# Altium schematic sheet ad7768.SchDoc
size A4; SheetNumber: 1; SheetTotal: 6
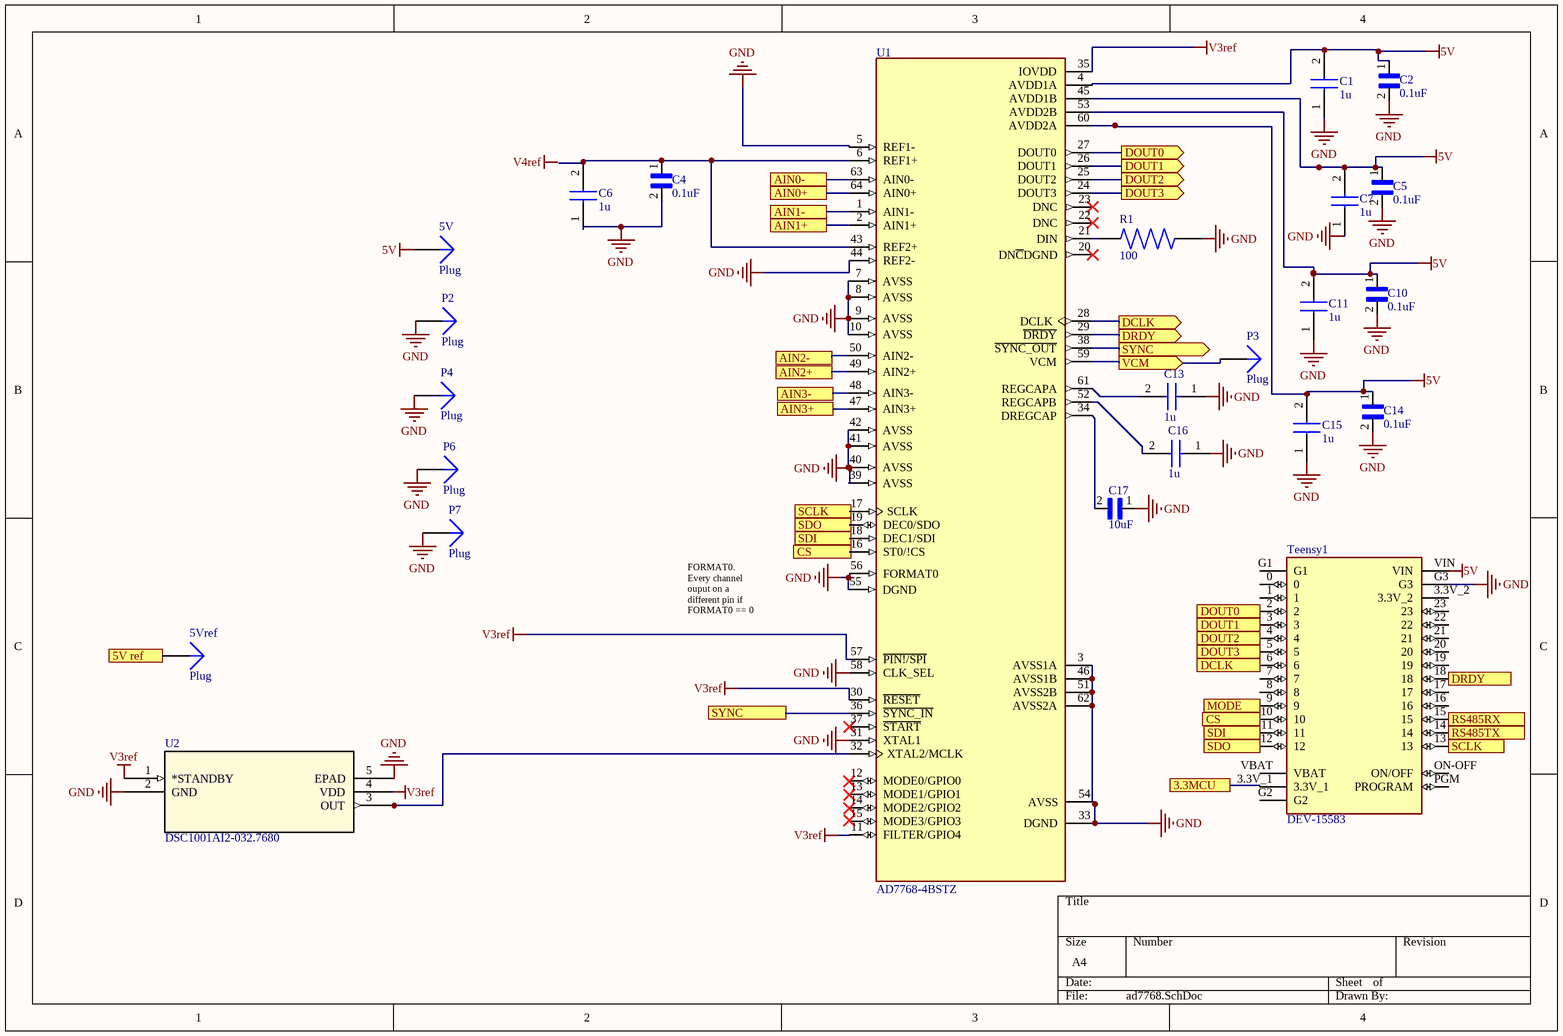
[diagram p0: ad7768.SchDoc]

## Parts
5V  Plug  [PIN1]
5Vref  Plug  [PIN1]
C1  1u  [CAPC1608X90N]
C2  0.1uF  [CAPC1608X90N]
C4  0.1uF  [CAPC1608X90N]
C5  0.1uF  [CAPC1608X90N]
C6  1u  [CAPC1608X90N]
C7  1u  [CAPC1608X90N]
C10  0.1uF  [CAPC1608X90N]
C11  1u  [CAPC1608X90N]
C13  1u  [CAPC1608X90N]
C14  0.1uF  [CAPC1608X90N]
C15  1u  [CAPC1608X90N]
C16  1u  [CAPC1608X90N]
C17  10uF  [CAPC1608X9N]
P2  Plug  [PIN1]
P3  Plug  [PIN1]
P4  Plug  [PIN1]
P6  Plug  [PIN1]
P7  Plug  [PIN1]
R1  100  [RESC1508X55N]
Teensy1  DEV-15583  [MODULE_DEV-15583]
U1  AD7768-4BSTZ
U2  DSC1001AI2-032.7680  [DFN4_7X5_MCH]

## Ports
3.3MCU, 5V ref, AIN0+, AIN0-, AIN1+, AIN1-, AIN2+, AIN2-, AIN3+, AIN3-, CS, DCLK (out), DOUT0 (out), DOUT1 (out), DOUT2 (out), DOUT3 (out), DRDY (out), MODE, RS485RX, RS485TX, SCLK, SDI, SDO, SYNC, SYNC (out), VCM (out)

## Nets
5V: 5V.1 C1.2 C2.1 C5.1 C7.2 C10.1 C11.2 C14.1 C15.2 Teensy1.VIN U1.4(AVDD1A) U1.45(AVDD1B) U1.53(AVDD2B) U1.60(AVDD2A)
GND: C1.1 C2.2 C4.2 C5.2 C6.1 C7.1 C10.2 C11.1 C13.1 C14.2 C15.1 C16.1 C17.1 P2.1 P4.1 P6.1 P7.1 R1.2 Teensy1.G3 U1.3(AVSS1A) U1.5(REF1-) U1.7(AVSS) U1.8(AVSS) U1.9(AVSS) U1.10(AVSS) U1.31(XTAL1) U1.33(DGND) U1.39(AVSS) U1.40(AVSS) U1.41(AVSS) U1.42(AVSS) U1.44(REF2-) U1.46(AVSS1B) U1.51(AVSS2B) U1.54(AVSS) U1.55(DGND) U1.56(FORMAT0) U1.58(CLK_SEL) U1.62(AVSS2A) U2.2(GND) U2.5(EPAD)
V3ref: U1.11(FILTER/GPIO4) U1.30(~{RESET}) U1.35(IOVDD) U1.57(~{PIN!/SPI}) U2.1(*STANDBY) U2.4(VDD)
3.3MCU: Teensy1.3.3V_1 ; port 3.3MCU
5V ref: 5Vref.1 ; port 5V ref
AIN0+: U1.64(AIN0+) ; port AIN0+
AIN0-: U1.63(AIN0-) ; port AIN0-
AIN1+: U1.2(AIN1+) ; port AIN1+
AIN1-: U1.1(AIN1-) ; port AIN1-
AIN2+: U1.49(AIN2+) ; port AIN2+
AIN2-: U1.50(AIN2-) ; port AIN2-
AIN3+: U1.47(AIN3+) ; port AIN3+
AIN3-: U1.48(AIN3-) ; port AIN3-
CS: Teensy1.10 U1.16(ST0/!CS) ; port CS
DCLK: Teensy1.6 U1.28(DCLK) ; port DCLK
DOUT0: Teensy1.2 U1.27(DOUT0) ; port DOUT0
DOUT1: Teensy1.3 U1.26(DOUT1) ; port DOUT1
DOUT2: Teensy1.4 U1.25(DOUT2) ; port DOUT2
DOUT3: Teensy1.5 U1.24(DOUT3) ; port DOUT3
DRDY: Teensy1.18 U1.29(~{DRDY}) ; port DRDY
MODE: Teensy1.9 ; port MODE
RS485RX: Teensy1.15 ; port RS485RX
RS485TX: Teensy1.14 ; port RS485TX
SCLK: Teensy1.13 U1.17(SCLK) ; port SCLK
SDI: Teensy1.11 U1.18(DEC1/SDI) ; port SDI
SDO: Teensy1.12 U1.19(DEC0/SDO) ; port SDO
SYNC: U1.36(~{SYNC_IN}) U1.38(~{SYNC_OUT}) ; port SYNC
VCM: P3.1 U1.59(VCM) ; port VCM
NetC4_1: C4.1 C6.2 U1.6(REF1+) U1.43(REF2+)
NetC13_2: C13.2 U1.61(REGCAPA)
NetC16_2: C16.2 U1.52(REGCAPB)
NetC17_2: C17.2 U1.34(DREGCAP)
NetR1_1: R1.1 U1.21(DIN)
NetU1_32: U1.32(XTAL2/MCLK) U2.3(OUT)

Not connected (* = marked no-connect by the designer): Teensy1 0 1 3.3V_2 7 8 16 17 19 20 21 22 23 G1 G2 ON-OFF(ON/OFF) PGM(PROGRAM) VBAT; U1 12(MODE0/GPIO0)* 13(MODE1/GPIO1)* 14(MODE2/GPIO2)* 15(MODE3/GPIO3) 20(DN~{C}DGND)* 22(DNC)* 23(DNC)* 37(~{START})*

## Notes on the sheet
- FORMAT0. Every channel ouput on a different pin if FORMAT0 == 0
- Labels drawn without touching a wire or pin: V4ref

## Library data of the parts
5V 5Vref P2-P4 P6 P7 = CMP-010-000007-1: Signal Integrity: Connector; LatestRevisionDate: 17-Jul-2002; LatestRevisionNote: Re-released for DXP Platform.; Publisher: Altium Limited; Component Type: Standard; Design Item ID: Plug; Pin Count: 1; Source: workerBoard.SCHLIB
C1 C6 C7 C11 C13 C15 C16 = CMP-003-000003-1: Capacitor; Manufacturer_Name: AVX; Datasheet Link: https://componentsearchengine.com/Datasheets/1/06031A100FAT2A.pdf; Height: 0.9mm; Manufacturer_Part_Number: 0603YC105MAT4A; Component Type: Standard; Design Item ID: 0603YC105MAT4A; Pin Count: 2; Source: workerBoard.SCHLIB
C2 C4 C5 C10 C14 = CMP-003-000001-1: Cap Ceramic 0.1uF 25V X5R 10% SMD 0603 85ÂÂŽ T/R; MF: {'manufacturer': u'AVX'}; Price: None; Availability: Unavailable; Value: *; MP: 06033D104KAT2A; Package: None; Component Type: Standard; Design Item ID: 06033D104KAT2A; Pin Count: 2; Source: workerBoard.SCHLIB
C17 = CMP-003-000008-1: CAP CER 10UF 10V X5R 0603; MP: GRT188R61A106ME13D; MF: {'manufacturer': u'Murata'}; Price: None; Availability: Unavailable; Value: *; Package: None; Component Type: Standard; Design Item ID: GRT188R61A106ME13D; Pin Count: 2; Source: workerBoard.SCHLIB
R1 = CMP-008-000002-1: MP: MCT0603MD1000DP500; MF: {'manufacturer': u'Vishay'}; Price: None; Availability: Unavailable; Value: *; Package: None; Component Type: Standard; Design Item ID: MCT0603MD1000DP500; Pin Count: 2; Source: workerBoard.SCHLIB
Teensy1 = CMP-010-000005-1: RT1062 Teensy 4.0 i.MX ARMÂ® CortexÂ®-M7 MPU Embedded Evaluation Board; MF: SparkFun Electronics; Value: *; Package: None; Digi-Key_Part_Number: 1568-DEV-15583-ND; Digi-Key_Purchase_URL: https://www.digikey.com/product-detail/en/sparkfun-electronics/DEV-15583/1568-DEV-15583-ND/10384551?utm_source=snapeda&utm_medium=aggregator&utm_campaign=symbol; MP: DEV-15583; SnapEDA_Link: https://www.snapeda.com/parts/DEV-15583/SparkFun%20Electronics/view-part/4001229/?ref=snap; Component Type: Standard; Design Item ID: DEV-15583; Pin Count: 33; Source: workerBoard.SCHLIB
U1 = CMP-005-000000-1: 24 Bit Analog to Digital Converter 4 Input 4 Sigma-Delta 64-LQFP _10x10_; MF: Analog Devices; Digi-Key_Purchase_URL: https://www.digikey.com/product-detail/en/analog-devices-inc/AD7768-4BSTZ/AD7768-4BSTZ-ND/6072260?utm_source=snapeda&utm_medium=aggregator&utm_campaign=symbol; Package: LQFP -64 Analog Devices; SnapEDA_Link: https://www.snapeda.com/parts/AD7768-4BSTZ/Analog%20Devices%20Inc./view-part/501603/?ref=snap; Value: *; MP: AD7768-4BSTZ; Digi-Key_Part_Number: AD7768-4BSTZ-ND; Component Type: Standard; Design Item ID: AD7768-4BSTZ; Pin Count: 64; Source: workerBoard.SCHLIB
U2 = CMP-010-000006-1: No Description Available; Mfr_Name: Microchip; Copyright: Copyright (C) 2021 Ultra Librarian. All rights reserved.; Manufacturer_Part_Number: DSC1001AI2-032.7680; Digi-Key_Part_Number_1: DSC1001AI2-032.7680-ND; RefDes: RefDes; Type: DEV; Component Type: Standard; Design Item ID: DSC1001AI2-032.7680; Pin Count: 5; Source: workerBoard.SCHLIB